# EasyEDA schematic Multivibrator.json
TITLE: Sheet_1; REV: 1.0; Date: 2023-03-16; Sheet: 1/1; Company: Your Company
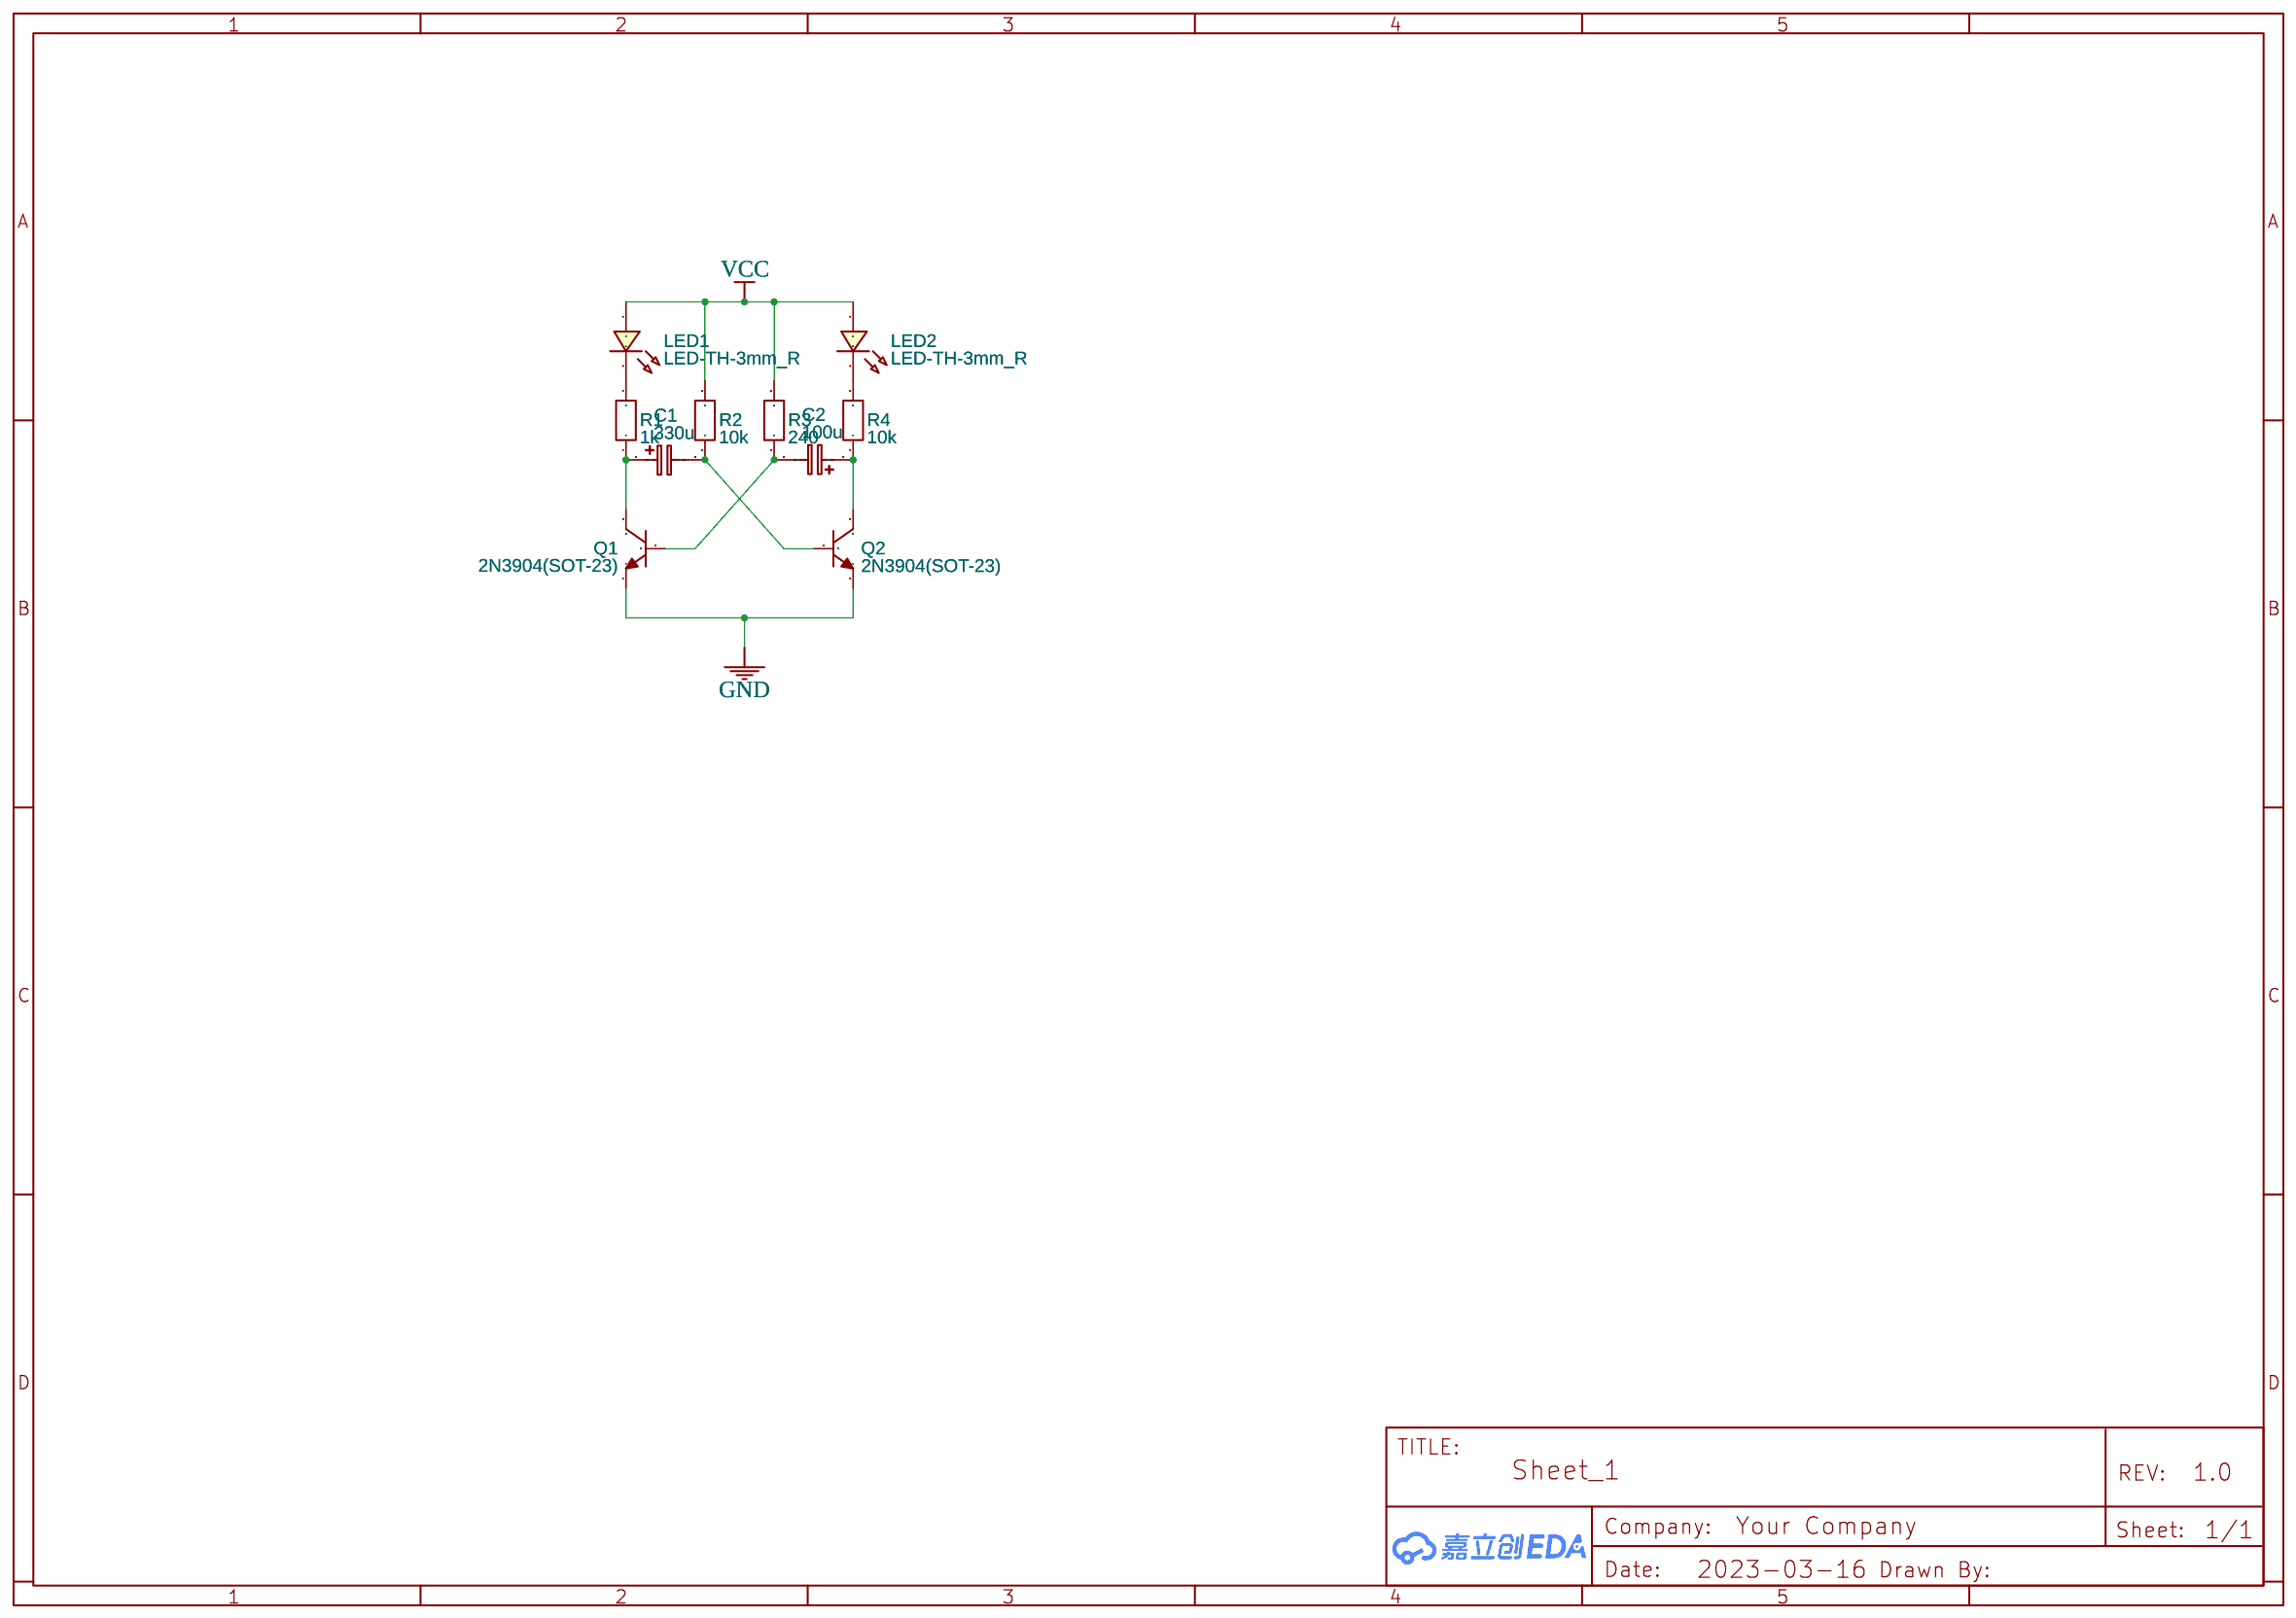
[diagram p0: schematic sheet]

## Parts
C1  330u  [CAP-D3.0×F1.5]
C2  100u  [CAP-D3.0×F1.5]
LED1  LED-TH-3mm_R  [LED-TH_BD3.0_RED]
LED2  LED-TH-3mm_R  [LED-TH_BD3.0_RED]
Q1  2N3904(SOT-23)  [BC337]
Q2  2N3904(SOT-23)  [BC337]
R1  1k  [R_AXIAL-0.3]
R2  10k  [R_AXIAL-0.3]
R3  240  [R_AXIAL-0.3]
R4  10k  [R_AXIAL-0.3]

## Library data of the parts
C1 C2 = CE_TH_D3.0×F1.5_EU: Contributor: LCEDA_Lib
LED1 LED2 = LED-TH-3mm_R: Manufacturer: EVERLIGHT(台湾亿光); Manufacturer Part: 204-10SDRD/S530-A3-L; Supplier Part: C84774; Supplier: LCSC; Contributor: LCEDA_Lib
Q1 Q2 = 2N3904(SOT-23): Supplier: LCSC; Manufacturer: KEC; Manufacturer Part: 2n3904S-RTK/PS; Supplier Part: C18536; Paste Type: SOT-23; Contributor: LCEDA_Lib
R1-R4 = R_AXIAL-0.3_EU: Contributor: LCEDA_Lib

## Nets
GND: Q1.1(E) Q2.1(E)
VCC: LED1.1 LED2.1 R2.2 R3.2
Net-(C1-1): C1.1 Q1.3(C) R1.1
Net-(C1-2): C1.2 Q2.2(B) R2.1
Net-(C2-1): C2.1 Q2.3(C) R4.1
Net-(C2-2): C2.2 Q1.2(B) R3.1
Net-(LED1-2): LED1.2 R1.2
Net-(LED2-2): LED2.2 R4.2
